# Altium schematic sheet epaper.SchDoc
size A; SheetNumber: 3; SheetTotal: 3
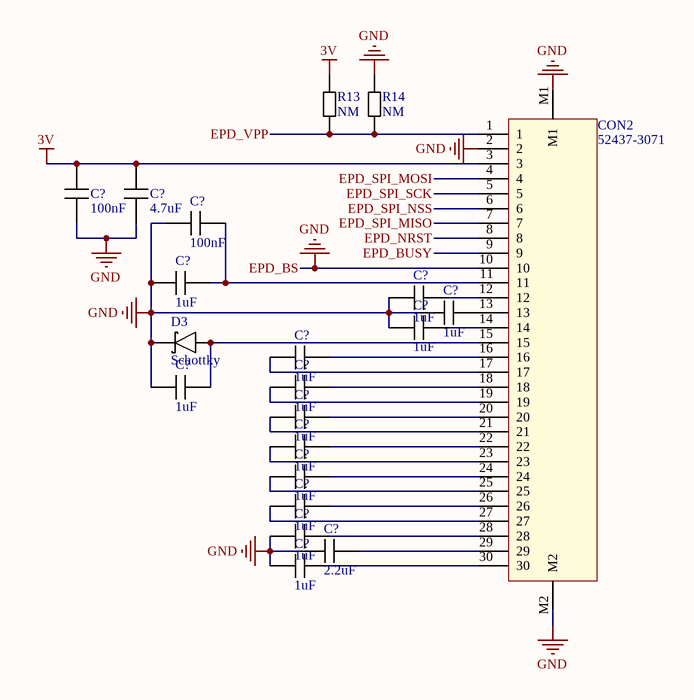
[diagram p0: epaper.SchDoc]

## Parts
(Parts that share a designator on the sheet are numbered #1, #2 ... from top to bottom, then left to right.)
C?#1  value 100nF  [C0402]  (hidden comment: 100nF (0402) AEC-Q200)
C?#2  value 4.7uF  [C0402]  (hidden comment: 4.7uF (0402) AEC-Q200)
C?#3  value 100nF  [C0402]  (hidden comment: 100nF (0402) AEC-Q200)
C?#4  value 1uF  [C0402]  (hidden comment: 1uF (0402))
C?#5  value 1uF  [C0402]  (hidden comment: 1uF (0402))
C?#6  value 1uF  [C0402]  (hidden comment: 1uF (0402))
C?#7  value 1uF  [C0402]  (hidden comment: 1uF (0402))
C?#8  value 1uF  [C0402]  (hidden comment: 1uF (0402))
C?#9  value 1uF  [C0402]  (hidden comment: 1uF (0402))
C?#10  value 1uF  [C0402]  (hidden comment: 1uF (0402))
C?#11  value 1uF  [C0402]  (hidden comment: 1uF (0402))
C?#12  value 1uF  [C0402]  (hidden comment: 1uF (0402))
C?#13  value 1uF  [C0402]  (hidden comment: 1uF (0402))
C?#14  value 1uF  [C0402]  (hidden comment: 1uF (0402))
C?#15  value 1uF  [C0402]  (hidden comment: 1uF (0402))
C?#16  value 2.2uF  [C0402]  (hidden comment: 2.2uF (0402) AEC-Q200)
C?#17  value 1uF  [C0402]  (hidden comment: 1uF (0402))
CON2  52437-3071  [52437-3071]
D3  value Schottky  [SOD-523 (0603)]  (hidden comment: 1PS79SB40 AEC-Q101)
R13  value NM  [R0402 (NM)]  (hidden comment: NM (0402))
R14  value NM  [R0402 (NM)]  (hidden comment: NM (0402))

## Nets
3V: C?#1.2 C?#2.1 CON2.3 R13.2
EPD_BS: C?#1.1 C?#2.2 C?#3.1 C?#4.1 C?#5.1 C?#6.1 C?#7.1 C?#9.1 C?#15.1 C?#16.2 C?#17.1 CON2.2 CON2.10 CON2.M1 CON2.M2 D3.K R14.2  [also labelled GND]
EPD_BUSY: CON2.9
EPD_NRST: CON2.8
EPD_SPI_MISO: CON2.7
EPD_SPI_MOSI: CON2.4
EPD_SPI_NSS: CON2.6
EPD_SPI_SCK: CON2.5
EPD_VPP: CON2.1 R13.1 R14.1
NetC?#3_2: C?#3.2 C?#4.2 CON2.11
NetC?#5_2: C?#5.2 CON2.12
NetC?#6_2: C?#6.2 CON2.13
NetC?#7_2: C?#7.2 CON2.14
NetC?#8_1: C?#8.1 CON2.17
NetC?#8_2: C?#8.2 CON2.16
NetC?#9_2: C?#9.2 CON2.15 D3.A
NetC?#10_1: C?#10.1 CON2.19
NetC?#10_2: C?#10.2 CON2.18
NetC?#11_1: C?#11.1 CON2.21
NetC?#11_2: C?#11.2 CON2.20
NetC?#12_1: C?#12.1 CON2.23
NetC?#12_2: C?#12.2 CON2.22
NetC?#13_1: C?#13.1 CON2.25
NetC?#13_2: C?#13.2 CON2.24
NetC?#14_1: C?#14.1 CON2.27
NetC?#14_2: C?#14.2 CON2.26
NetC?#15_2: C?#15.2 CON2.28
NetC?#16_1: C?#16.1 CON2.29
NetC?#17_2: C?#17.2 CON2.30

## Library data of the parts
C?#1 C?#3 = 100nF (0402) AEC-Q200: X7R 0402 10% 50V AEC-Q200; Référence: GCM155R71H104KE02J; Fabricant: MURATA
C?#2 = 4.7uF (0402) AEC-Q200: X7T 0402 10% 6.3V AEC-Q200; Référence: KAM05CT70J475KH; Fabricant: KYOCERA AVX
C?#4-C?#15 C?#17 = 1uF (0402): X7S 10% 0402 16V; Fabricant: MURATA; Référence: GRM155C71C105KE11D
C?#16 = 2.2uF (0402) AEC-Q200: X7S 0402 10% 10V AEC-Q200; Fabricant: MURATA; Référence: GRT155C71A225KE13D
CON2 = 52437-3071: Connecteur FFC/FPC, Right-Angle, Surface Mount, ZIF, Bottom Contact / Style, 30 Circuits; Fabricant: MOLEX; Référence: 52437-3071; Value: 52437-3071
D3 = 1PS79SB40 AEC-Q101: Diode Schottky SOD-523 AEC-Q101; Fabricant: Nexperia; Référence: 1PS79SB40,115